# Altium schematic sheet S1-C1-UPS.SchDoc
size A; SheetNumber: 1; SheetTotal: 1
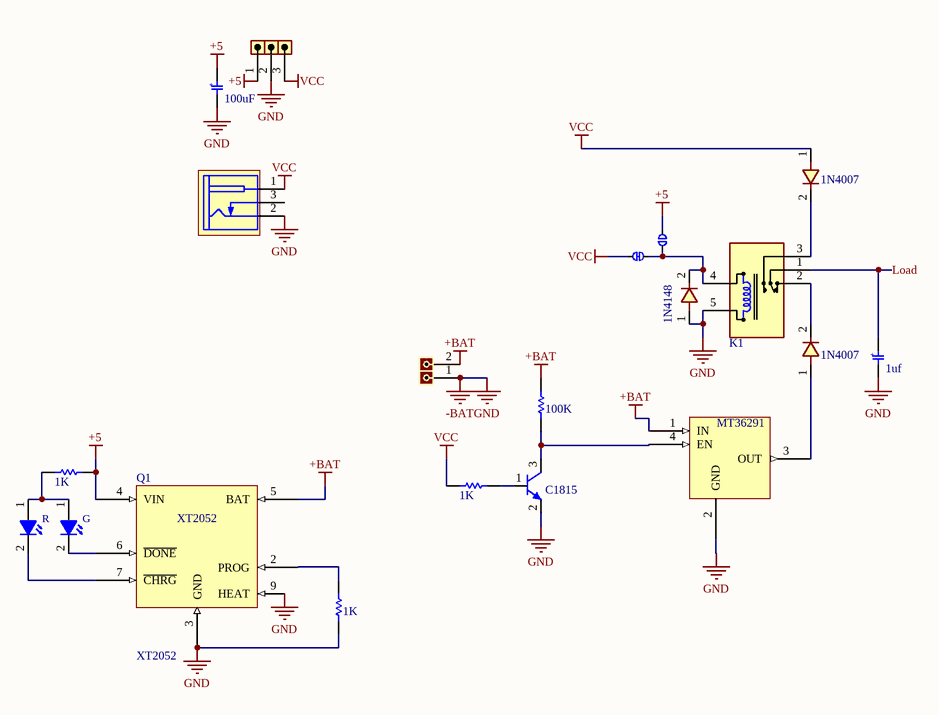
[diagram p0: S1-C1-UPS.SchDoc]

## Parts
*1  SB-NC  [SB-NC]  (value not drawn)
*2  MT36291 Module  [Module]  (value not drawn)
C1  value 100uF  [C_EL_8X12]  (hidden comment: Capacitor Electrical THD)
C2  value 1uf  [C_EL_10X12]  (hidden comment: Capacitor Electrical THD)
D1  value 1N4007  [D_SMA]  (hidden comment: 1N4007 SMD M7)
D2  value 1N4148  [D_SMA]  (hidden comment: 1N4007 SMD M7)
D3  value 1N4007  [D_SMA]  (hidden comment: 1N4007 SMD M7)
D4  R  [LED SMD 0805 (Red)]
D5  G  [LED SMD 0805 (Green)]
J1  Female Header Single 3  [HDR_F_1X3]  (value not drawn)
J2  Power Jack  [POWER J1]  (value not drawn)
K1  RELAY SPST 5 Pin Millon  [REL_SPDT_5_2216]  (value not drawn)
P1  Male Header Single 02  [MHDR1X02-254P]  (value not drawn)
Q1  XT2052  [XT2052]
Q2  value C1815  [SOT-23]  (hidden comment: C1815 NPN)
R1  value 100K  [R0805]  (hidden comment: Resistor SMD 0805)
R2  value 1K  [R0805]  (hidden comment: Resistor SMD 0805)
R3  value 1K  [R0805]  (hidden comment: Resistor SMD 0805)
R4  value 1K  [R0805]  (hidden comment: Resistor SMD 0805)
SB1  Solid Bridge  [SB-NO]  (value not drawn)

## Nets
+5: C1.1 J1.1 Q1.4(VIN) R2.2 SB1.2
+BAT: *2.1(IN) P1.2 Q1.5(BAT) R1.1
-BAT: *2.2(GND) C1.2 C2.2 D2.1 J1.2 J2.2(SLEEVE) K1.5(T2) P1.1 Q1.3(GND) Q1.9(HEAT) Q2.2(E) R4.1  [also labelled GND]
VCC: *1.2 D1.1 J1.3 J2.1(TIP) R3.2
Load: C2.1 K1.1(COM)
Net*1_1: *1.1 D2.2 K1.4(T1) SB1.1
Net*2_3: *2.3(OUT) D3.1
Net*2_4: *2.4(EN) Q2.3(C) R1.2
NetD1_2: D1.2 K1.3(NO)
NetD3_2: D3.2 K1.2(NC)
NetD4_1: D4.1(ANODE) D5.1(ANODE) R2.1
NetD4_2: D4.2(CATHODE) Q1.7(~{CHRG})
NetD5_2: D5.2(CATHODE) Q1.6(~{DONE})
NetQ1_2: Q1.2(PROG) R4.2
NetQ2_1: Q2.1(B) R3.1

Not connected (* = marked no-connect by the designer): J2 3(INSERTION_DET)

## Notes on the sheet
- (in symbol Capacitor Electrical THD) +
- (in symbol MT36291 Module) MT36291

## Library data of the parts
D1-D3 = 1N4007 SMD M7: DIODE, GENERAL PURPOSE, 1000V/1A; DatasheetVersion: 2022; ComponentLink1Description: Tarahiboard; ComponentLink1URL: https://www.tarahiboard.com/product/library-pack
D4 D5 = LED SMD 0805: ComponentLink1Description: Tarahiboard; ComponentLink1URL: https://www.tarahiboard.com/product/library-pack; DatasheetVersion: 2022
J1 = Female Header Single 3: Female, pitch: 2.54mm; ComponentLink1Description: Tarahiboard; ComponentLink1URL: https://www.tarahiboard.com/product/library-pack; DatasheetVersion: 2022
K1 = RELAY SPST 5 Pin Millon: Relay; ComponentLinkp-URL: https://www.smartw.ir/; DatasheetVersion: 2022; ComponentLink1Description: Tarahiboard; ComponentLink1URL: https://www.tarahiboard.com/product/library-pack
P1 = Male Header Single 02: Male, pitch: 2.54mm; ComponentLink1Description: Tarahiboard; ComponentLink1URL: https://www.tarahiboard.com/product/library-pack; DatasheetVersion: 2022
SB1 = SB-NO
C1 C2 = Capacitor Electrical THD: DatasheetVersion: 20222; ComponentLink1Description: Tarahiboard; ComponentLink1URL: https://www.tarahiboard.com
J2 = Power Jack: DatasheetVersion: 2022; ComponentLink1Description: Tarahiboard; ComponentLink1URL: https://www.tarahiboard.com/product/library-pack
Q2 = C1815 NPN: ComponentLink1Description: Tarahiboard; ComponentLink1URL: https://www.tarahiboard.com/product/library-pack; DatasheetVersion: 2022
R1-R4 = Resistor SMD 0805: DatasheetVersion: 2022; ComponentLink1Description: Website: Tarahiboard; ComponentLink1URL: https://www.tarahiboard.com/product/library-pack